# Altium schematic sheet Connectors_OLD.SchDoc: Set in Document Options » Parameters » Title
size A4; Author: Set in Document Options » Parameters » Author + Contact info
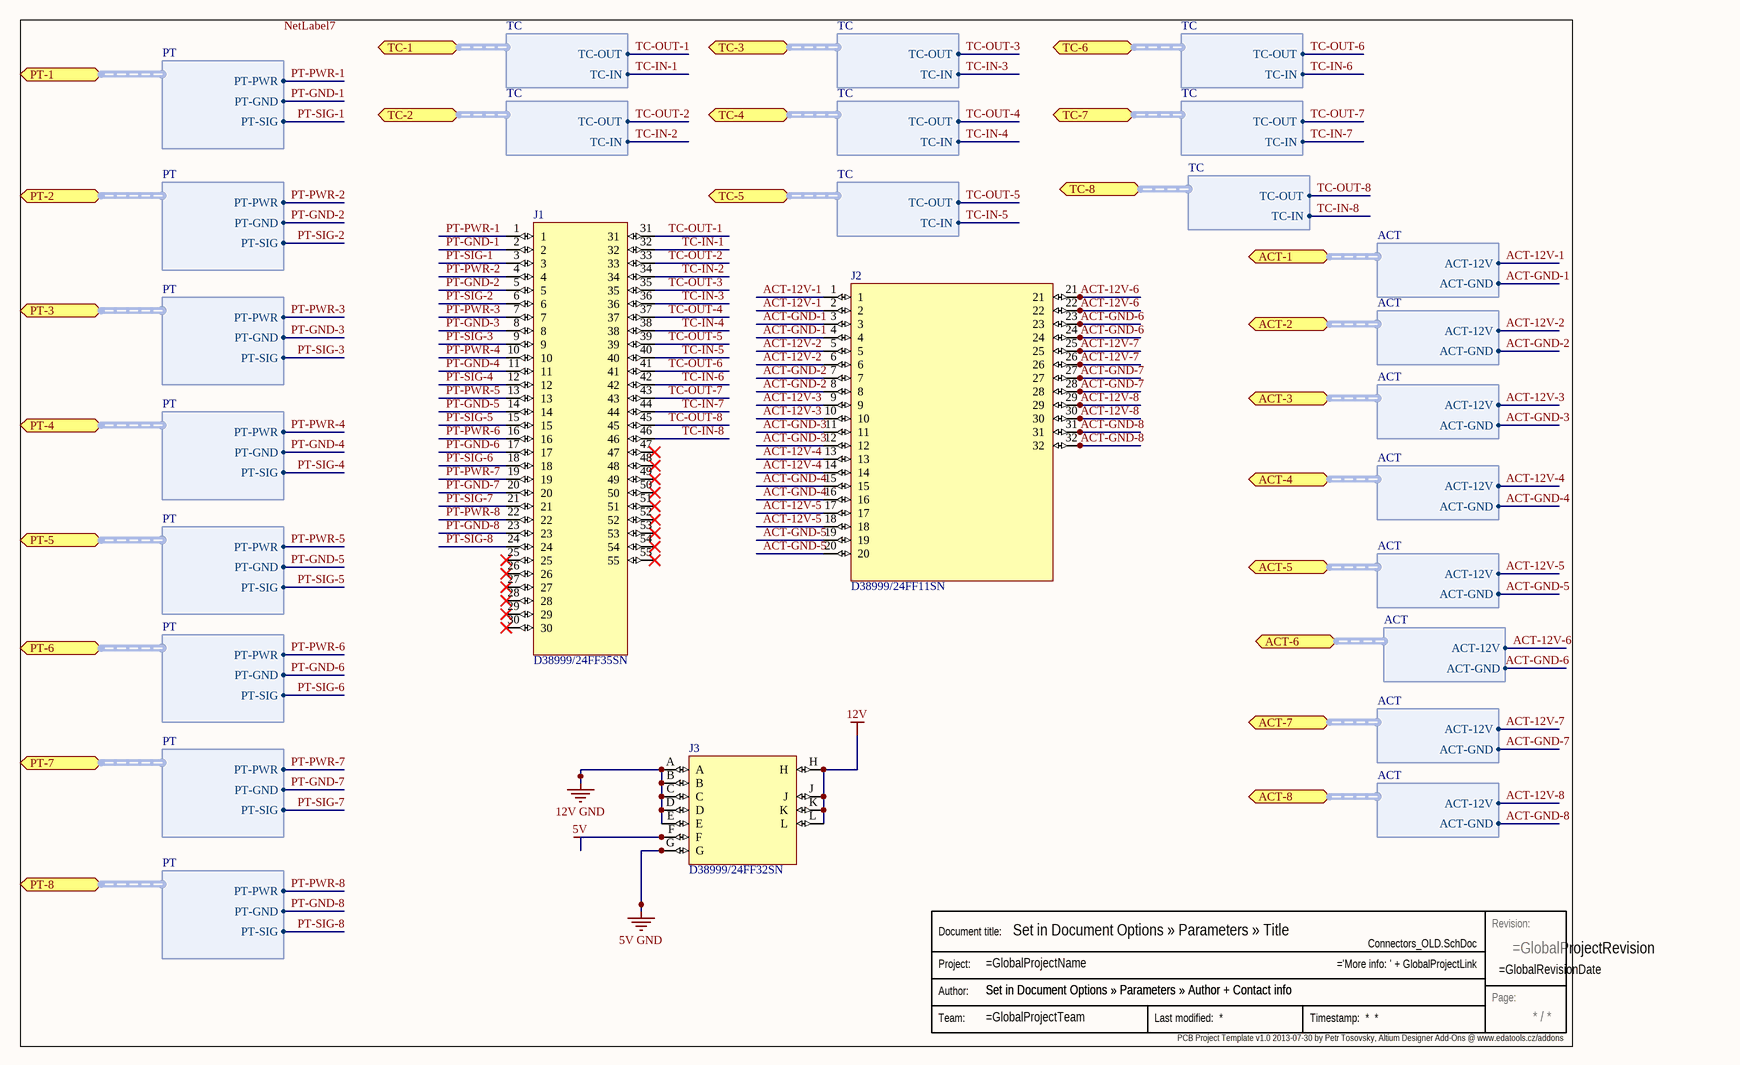
[diagram p0: Connectors_OLD.SchDoc]

## Parts
J1  D38999/24FF35SN  [17-35]
J2  D38999/24FF11SN  [19-32]
J3  D38999/24FF32SN  [19-11]
Stamp  Stamp  (value not drawn)  (graphical)

## Ports
ACT-1 (harness ACT), ACT-2 (harness ACT), ACT-3 (harness ACT), ACT-4 (harness ACT), ACT-5 (harness ACT), ACT-6 (harness ACT), ACT-7 (harness ACT), ACT-8 (harness ACT), PT-1 (harness PT), PT-2 (harness PT), PT-3 (harness PT), PT-4 (harness PT), PT-5 (harness PT), PT-6 (harness PT), PT-7 (harness PT), PT-8 (harness PT), TC-1 (harness TC), TC-2 (harness TC), TC-3 (harness TC), TC-4 (harness TC), TC-5 (harness TC), TC-6 (harness TC), TC-7 (harness TC), TC-8 (harness TC)

## Harnesses
PT: PT-SIG, PT-GND, PT-PWR
TC: TC-IN, TC-OUT
ACT: ACT-GND, ACT-12V

## Nets
5V: J3.F
5V GND: J3.G
12V: J3.H J3.J J3.K J3.L
12V GND: J3.A J3.B J3.C J3.D J3.E
ACT-12V-1: J2.1 J2.2 ; port ACT-1.ACT-12V
ACT-12V-2: J2.5 J2.6 ; port ACT-2.ACT-12V
ACT-12V-3: J2.9 J2.10 ; port ACT-3.ACT-12V
ACT-12V-4: J2.13 J2.14 ; port ACT-4.ACT-12V
ACT-12V-5: J2.17 J2.18 ; port ACT-5.ACT-12V
ACT-12V-6: J2.21 J2.22 ; port ACT-6.ACT-12V
ACT-12V-7: J2.25 J2.26 ; port ACT-7.ACT-12V
ACT-12V-8: J2.29 J2.30 ; port ACT-8.ACT-12V
ACT-GND-1: J2.3 J2.4 ; port ACT-1.ACT-GND
ACT-GND-2: J2.7 J2.8 ; port ACT-2.ACT-GND
ACT-GND-3: J2.11 J2.12 ; port ACT-3.ACT-GND
ACT-GND-4: J2.15 J2.16 ; port ACT-4.ACT-GND
ACT-GND-5: J2.19 J2.20 ; port ACT-5.ACT-GND
ACT-GND-6: J2.23 J2.24 ; port ACT-6.ACT-GND
ACT-GND-7: J2.27 J2.28 ; port ACT-7.ACT-GND
ACT-GND-8: J2.31 J2.32 ; port ACT-8.ACT-GND
PT-GND-1: J1.2 ; port PT-1.PT-GND
PT-GND-2: J1.5 ; port PT-2.PT-GND
PT-GND-3: J1.8 ; port PT-3.PT-GND
PT-GND-4: J1.11 ; port PT-4.PT-GND
PT-GND-5: J1.14 ; port PT-5.PT-GND
PT-GND-6: J1.17 ; port PT-6.PT-GND
PT-GND-7: J1.20 ; port PT-7.PT-GND
PT-GND-8: J1.23 ; port PT-8.PT-GND
PT-PWR-1: J1.1 ; port PT-1.PT-PWR
PT-PWR-2: J1.4 ; port PT-2.PT-PWR
PT-PWR-3: J1.7 ; port PT-3.PT-PWR
PT-PWR-4: J1.10 ; port PT-4.PT-PWR
PT-PWR-5: J1.13 ; port PT-5.PT-PWR
PT-PWR-6: J1.16 ; port PT-6.PT-PWR
PT-PWR-7: J1.19 ; port PT-7.PT-PWR
PT-PWR-8: J1.22 ; port PT-8.PT-PWR
PT-SIG-1: J1.3 ; port PT-1.PT-SIG
PT-SIG-2: J1.6 ; port PT-2.PT-SIG
PT-SIG-3: J1.9 ; port PT-3.PT-SIG
PT-SIG-4: J1.12 ; port PT-4.PT-SIG
PT-SIG-5: J1.15 ; port PT-5.PT-SIG
PT-SIG-6: J1.18 ; port PT-6.PT-SIG
PT-SIG-7: J1.21 ; port PT-7.PT-SIG
PT-SIG-8: J1.24 ; port PT-8.PT-SIG
TC-IN-1: J1.32 ; port TC-1.TC-IN
TC-IN-2: J1.34 ; port TC-2.TC-IN
TC-IN-3: J1.36 ; port TC-3.TC-IN
TC-IN-4: J1.38 ; port TC-4.TC-IN
TC-IN-5: J1.40 ; port TC-5.TC-IN
TC-IN-6: J1.42 ; port TC-6.TC-IN
TC-IN-7: J1.44 ; port TC-7.TC-IN
TC-IN-8: J1.46 ; port TC-8.TC-IN
TC-OUT-1: J1.31 ; port TC-1.TC-OUT
TC-OUT-2: J1.33 ; port TC-2.TC-OUT
TC-OUT-3: J1.35 ; port TC-3.TC-OUT
TC-OUT-4: J1.37 ; port TC-4.TC-OUT
TC-OUT-5: J1.39 ; port TC-5.TC-OUT
TC-OUT-6: J1.41 ; port TC-6.TC-OUT
TC-OUT-7: J1.43 ; port TC-7.TC-OUT
TC-OUT-8: J1.45 ; port TC-8.TC-OUT

Not connected (* = marked no-connect by the designer): J1 25* 26* 27* 28* 29* 30* 47* 48* 49* 50* 51* 52* 53* 54* 55*

## Notes on the sheet
- PCB Project Template v1.0 2013-07-30 by Petr Tosovsky, Altium Designer Add-Ons @ www.edatools.cz/addons <http://www.edatools.cz/addons>
- Labels drawn without touching a wire or pin: NetLabel7
- (in symbol Stamp) Revision:; Document title:; Project:; Author:; Page:; Team:

## Library data of the parts
J1 = D38999/24FF35SN: D38999/24FE35SN